# EAGLE board scoutfly_nxp (EAGLE 5.06)
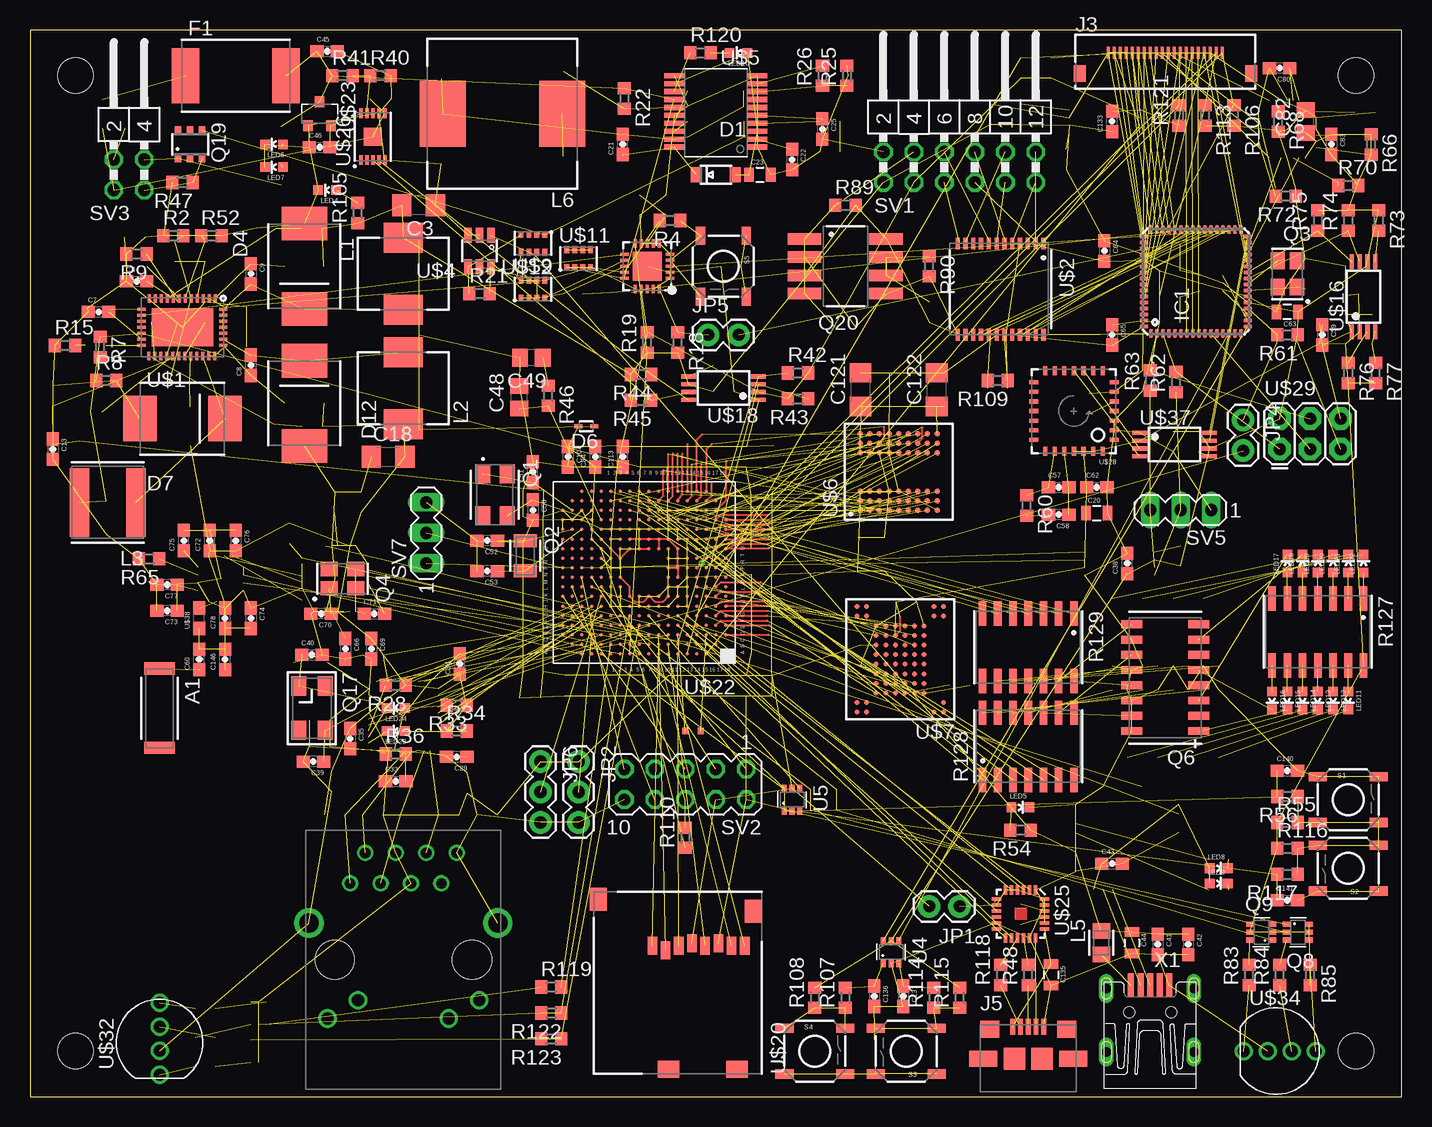
[diagram p8: board, top side]
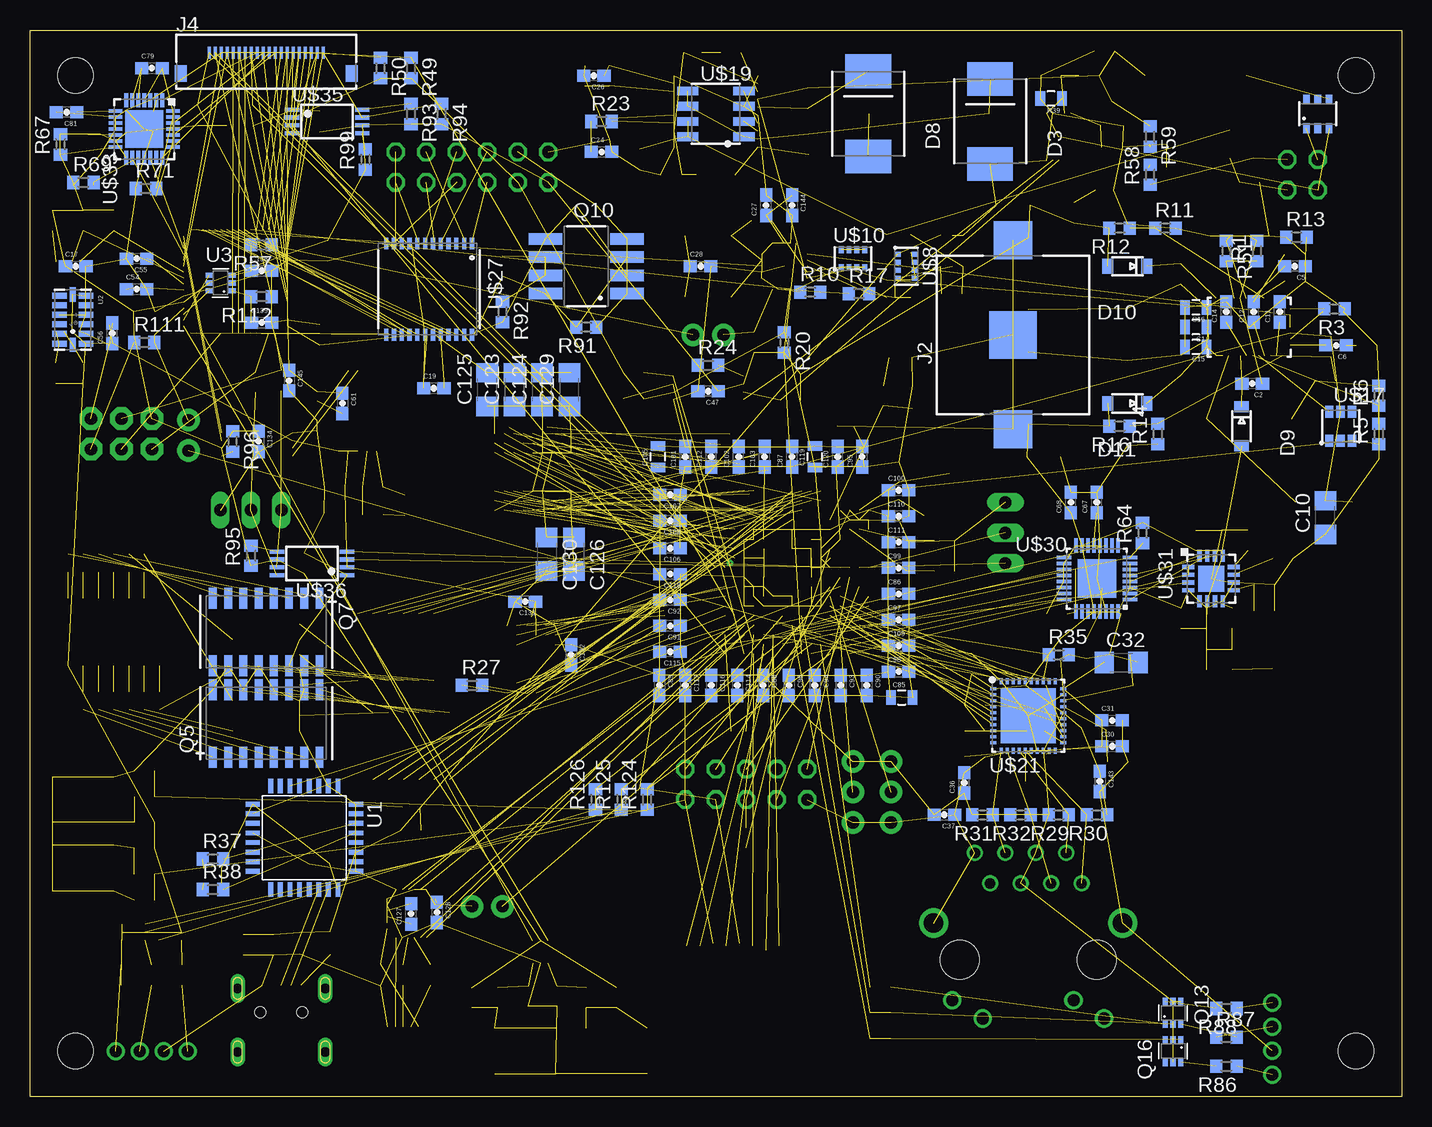
[diagram p9: board, bottom side, seen from below]

Size 114.3 x 88.9 mm. Coordinates in mm from the lower left corner, seen from the top.
Outline: 0,0 114.3,0 114.3,88.9 0,88.9 0,0
Copper layers (1*2+15*16): Top 0.035mm / dielectric 1.5mm / Route2 0.035mm / dielectric 0.15mm / Route15 0.035mm / dielectric 0.2mm / Bottom 0.035mm
Design rules "barebonespcb *": minimum track width 6mil, minimum drill 15mil, track to track 7mil, track to pad 7mil, pad to pad 7mil, via to via 7mil, smd to smd 7mil, copper to edge 10mil, drill to drill 8mil, minimum pad ring 7mil, minimum via ring 7mil, stop-mask expansion 4mil, vias tented up to drill 0mil, thermal gap 10mil
Holes 2.95 mm at 110.49,85.09 110.49,3.81 3.81,3.81 3.81,85.09

## Footprints (pad centres in the part's own frame; a part is rotated, then mirrored left to right if it is on the bottom)
CHIP_ANT_2.4GHZ = smd 1.016 x 2.54: 1 -3.302,0; 2 3.302,0
0805 = smd 0.8 x 1.2: 1 -0.9,0; 2 0.9,0
0603-CAP = smd 1.1 x 1: 1 -0.85,0; 2 0.85,0
C1206 = smd 1.6 x 1.8: 1 -1.4,0; 2 1.4,0
C0805 = smd 1.3 x 1.5: 1 -0.95,0; 2 0.95,0
SOD-123 = smd 0.914 x 1.219: 1 -1.638,0; 2 1.638,0
SMC/DO-214AB = smd 2.8 x 3.8: 1 -3.55,0; 2 3.55,0
SOD523 = smd 0.65 x 0.3: 1 -0.675,0; 2 0.675,0
SM200 = smd 2.3 x 4.6: 1 -4.2,0; 2 4.2,0
MLF64 = smd 0.7 x 0.3: 1 -4.325,3.75; 2 -4.325,3.25; 3 -4.325,2.75; 4 -4.325,2.25; 5 -4.325,1.75; 6 -4.325,1.25; 7 -4.325,0.75; 8 -4.325,0.25; 9 -4.325,-0.25; 10 -4.325,-0.75; 11 -4.325,-1.25; 12 -4.325,-1.75; 13 -4.325,-2.25; 14 -4.325,-2.75; 15 -4.325,-3.25; 16 -4.325,-3.75; 33 4.325,-3.75; 34 4.325,-3.25; 35 4.325,-2.75; 36 4.325,-2.25; 37 4.325,-1.75; 38 4.325,-1.25; 39 4.325,-0.75; 40 4.325,-0.25; 41 4.325,0.25; 42 4.325,0.75; 43 4.325,1.25; 44 4.325,1.75; 45 4.325,2.25; 46 4.325,2.75; 47 4.325,3.25; 48 4.325,3.75 | smd 0.3 x 0.7: 17 -3.75,-4.325; 18 -3.25,-4.325; 19 -2.75,-4.325; 20 -2.25,-4.325; 21 -1.75,-4.325; 22 -1.25,-4.325; 23 -0.75,-4.325; 24 -0.25,-4.325; 25 0.25,-4.325; 26 0.75,-4.325; 27 1.25,-4.325; 28 1.75,-4.325; 29 2.25,-4.325; 30 2.75,-4.325; 31 3.25,-4.325; 32 3.75,-4.325; 49 3.75,4.325; 50 3.25,4.325; 51 2.75,4.325; 52 2.25,4.325; 53 1.75,4.325; 54 1.25,4.325; 55 0.75,4.325; 56 0.25,4.325; 57 -0.25,4.325; 58 -0.75,4.325; 59 -1.25,4.325; 60 -1.75,4.325; 61 -2.25,4.325; 62 -2.75,4.325; 63 -3.25,4.325; 64 -3.75,4.325
RJ45-PULSE = drill 0.889 round: 1 4.445,-6.35; 2 3.175,-8.89; 3 1.905,-6.35; 4 0.635,-8.89; 5 -0.635,-6.35; 6 -1.905,-8.89; 7 -3.175,-6.35; 8 -4.445,-8.89 | drill 1.016 round: 9 6.325,4.902; 10 3.785,3.378; 11 -3.785,4.902; 12 -6.325,3.378 | drill 1.626 round: SHIELD1 -7.874,-3.048; SHIELD2 7.874,-3.048 | hole 3.251: 5.715,0; -5.715,0
COIN_CELL = smd 3.962 x 3.962: NEGATIVE 0,0 | smd 3.175 x 3.175: PLUS1 -7.874,0; PLUS2 7.874,0
OMRON_XF = smd 0.25 x 1: 1 -4.75,0; 2 -4.25,0; 3 -3.75,0; 4 -3.25,0; 5 -2.75,0; 6 -2.25,0; 7 -1.75,0; 8 -1.25,0; 9 -0.75,0; 10 -0.25,0; 11 0.25,0; 12 0.75,0; 13 1.25,0; 14 1.75,0; 15 2.25,0; 16 2.75,0; 17 3.25,0; 18 3.75,0; 19 4.25,0; 20 4.75,0 | smd 1 x 1.34: SOLDER_PAD1 -7.14,-1.72; SOLDER_PAD2 7.14,-1.72
MICRO_USB_AB_TYCO = smd 0.4 x 1.35: 1 -1.3,2.675; 2 -0.65,2.675; 3 0,2.675; 4 0.65,2.675; 5 1.3,2.675 | smd 1.6 x 1.4: PAD1 3.2,2.45; PAD2 -3.2,2.45 | smd 2.3 x 1.3: PAD3 3.75,0; PAD4 -3.75,0 | smd 1.8 x 1.8: PAD5 1.15,0; PAD6 -1.15,0
1X02 = drill 1.016 pad 1.88 round: 1 0,0; 2 2.54,0
1X03 = drill 1.016 pad 1.88 round: 1 0,0; 2 2.54,0; 3 5.08,0
DR74 = smd 2.5 x 3.25: 1 -3,0; 2 3,0
NR6045 = smd 1.6 x 5.7: 1 -2.35,0; 2 2.35,0
0805' = smd 1.285 x 1.47: 1 -0.973,0; 2 0.973,0
DR125 = smd 3.85 x 5.5: 1 -4.975,0; 2 4.975,0
LED-0603 = smd 0.8 x 0.8: A 0,-0.75; C 0,0.75
NX5032SA = smd 1.6 x 1.25: 1 1.75,1.025; 2 -1.75,1.025; 3 -1.75,-1.025; 4 1.75,-1.025
ECX-31B = smd 1.1 x 1.9: 1 -1.25,0; 2 1.25,0
NX3225SA = smd 1.4 x 1.2: 1 -1.1,-0.8; 2 1.1,-0.8; 3 1.1,0.8; 4 -1.1,0.8
16-SOIC = smd 0.65 x 1.75: 1 -4.445,-2.8; 2 -3.175,-2.8; 3 -1.905,-2.8; 4 -0.635,-2.8; 5 0.635,-2.8; 6 1.905,-2.8; 7 3.175,-2.8; 8 4.445,-2.8; 9 4.445,2.8; 10 3.175,2.8; 11 1.905,2.8; 12 0.635,2.8; 13 -0.635,2.8; 14 -1.905,2.8; 15 -3.175,2.8; 16 -4.445,2.8
SOT363 = smd 0.42 x 0.6: 1 -0.65,-0.95; 2 0,-0.95; 3 0.65,-0.95; 4 0.65,0.95; 5 0,0.95; 6 -0.65,0.95
SOT223-8 = smd 0.95 x 2.8: 1 -2.28,-3.4; 2 -0.76,-3.4; 3 0.76,-3.4; 4 2.28,-3.4; 5 2.28,3.4; 6 0.76,3.4; 7 -0.76,3.4; 8 -2.28,3.4
ECX-53B = smd 1.6 x 1.25: 1 -1.85,-1.1; 2 1.85,-1.1; 3 1.85,1.1; 4 -1.85,1.1
SOT26 = smd 0.55 x 0.8: 1 -0.95,-1.2; 2 0,-1.2; 3 0.95,-1.2; 4 0.95,1.2; 5 0,1.2; 6 -0.95,1.2
6-TSOP = smd 0.508 x 0.699: 1 -1.001,-1.163; 2 0,-1.163; 3 1.001,-1.163; 4 1.001,1.163; 5 0,1.163; 6 -1.001,1.163
R0603 = smd 1 x 1.1: 1 -0.85,0; 2 0.85,0
14-SOIC_CTS = smd 2.03 x 0.63: 1 -2.8,3.81; 2 -2.8,2.54; 3 -2.8,1.27; 4 -2.8,0; 5 -2.8,-1.27; 6 -2.8,-2.54; 7 -2.8,-3.81; 8 2.8,-3.81; 9 2.8,-2.54; 10 2.8,-1.27; 11 2.8,0; 12 2.8,1.27; 13 2.8,2.54; 14 2.8,3.81
TACTILE_SWITCH_SMD = smd 1.524 x 0.762: 1 -2.54,1.905; 2 2.54,1.905; 3 -2.54,-1.905; 4 2.54,-1.905
MA06-2W = drill 1.016 octagon: 1 -7.62,-1.27; 2 -7.62,1.27; 3 -5.08,-1.27; 4 -5.08,1.27; 5 -2.54,-1.27; 6 -2.54,1.27; 7 0,-1.27; 8 0,1.27; 9 2.54,-1.27; 10 2.54,1.27; 11 5.08,-1.27; 12 5.08,1.27
MA05-2 = drill 1.016 octagon: 1 -5.08,-1.27; 2 -5.08,1.27; 3 -2.54,-1.27; 4 -2.54,1.27; 5 0,-1.27; 6 0,1.27; 7 2.54,-1.27; 8 2.54,1.27; 9 5.08,-1.27; 10 5.08,1.27
MA02-2W = drill 1.016 octagon: 1 -1.27,-5.08; 2 -1.27,-2.54; 3 1.27,-5.08; 4 1.27,-2.54
MA03-1 = drill 1.016 long: 1 -2.54,0; 2 0,0; 3 2.54,0
PAD.02X.02 = smd 0.508 x 0.508: P$1 0,0
LQFP32 = smd 0.4 x 1.2: 1 -2.8,-4.3; 2 -2,-4.3; 3 -1.2,-4.3; 4 -0.4,-4.3; 5 0.4,-4.3; 6 1.2,-4.3; 7 2,-4.3; 8 2.8,-4.3; 17 2.8,4.3; 18 2,4.3; 19 1.2,4.3; 20 0.4,4.3; 21 -0.4,4.3; 22 -1.2,4.3; 23 -2,4.3; 24 -2.8,4.3 | smd 1.2 x 0.4: 9 4.3,-2.8; 10 4.3,-2; 11 4.3,-1.2; 12 4.3,-0.4; 13 4.3,0.4; 14 4.3,1.2; 15 4.3,2; 16 4.3,2.8; 25 -4.3,2.8; 26 -4.3,2; 27 -4.3,1.2; 28 -4.3,0.4; 29 -4.3,-0.4; 30 -4.3,-1.2; 31 -4.3,-2; 32 -4.3,-2.8
LGA14 = smd 0.5 x 1.2: 1 2,1.1; 2 1.2,1.1; 3 0.4,1.1; 4 -0.4,1.1; 5 -1.2,1.1; 6 -2,1.1; 8 -2,-1.1; 9 -1.2,-1.1; 10 -0.4,-1.1; 11 0.4,-1.1; 12 1.2,-1.1; 13 2,-1.1 | smd 1.2 x 0.5: 7 -2.1,0; 14 2.1,0
38-QFN = smd 0.7 x 0.25: 1 -2.4,2.75; 2 -2.4,2.25; 3 -2.4,1.75; 4 -2.4,1.25; 5 -2.4,0.75; 6 -2.4,0.25; 7 -2.4,-0.25; 8 -2.4,-0.75; 9 -2.4,-1.25; 10 -2.4,-1.75; 11 -2.4,-2.25; 12 -2.4,-2.75; 20 2.4,-2.8; 21 2.4,-2.3; 22 2.4,-1.8; 23 2.4,-1.3; 24 2.4,-0.8; 25 2.4,-0.3; 26 2.4,0.2; 27 2.4,0.7; 28 2.4,1.2; 29 2.4,1.7; 30 2.4,2.2; 31 2.4,2.7 | smd 0.25 x 0.7: 13 -1.5,-3.4; 14 -1,-3.4; 15 -0.5,-3.4; 16 0,-3.4; 17 0.5,-3.4; 18 1,-3.4; 19 1.5,-3.4; 32 1.5,3.4; 33 1,3.4; 34 0.5,3.4; 35 0,3.4; 36 -0.5,3.4; 37 -1,3.4; 38 -1.5,3.4 | smd 3.15 x 5.15: 39 0,0
24-SSOP = smd 0.35 x 0.97: 1 0,-3.81; 2 0.65,-3.81; 3 1.3,-3.81; 4 1.95,-3.81; 5 2.6,-3.81; 6 3.25,-3.81; 7 3.9,-3.81; 8 4.55,-3.81; 9 5.2,-3.81; 10 5.85,-3.81; 11 6.5,-3.81; 12 7.15,-3.81; 13 7.15,3.81; 14 6.5,3.81; 15 5.85,3.81; 16 5.2,3.81; 17 4.55,3.81; 18 3.9,3.81; 19 3.25,3.81; 20 2.6,3.81; 21 1.95,3.81; 22 1.3,3.81; 23 0.65,3.81; 24 0,3.81
20-QFN = smd 0.7 x 0.25: 1 -1.9,1; 2 -1.9,0.5; 3 -1.9,0; 4 -1.9,-0.5; 5 -1.9,-1; 11 1.9,-1; 12 1.9,-0.5; 13 1.9,0; 14 1.9,0.5; 15 1.9,1 | smd 0.25 x 0.7: 6 -1,-1.9; 7 -0.5,-1.9; 8 0,-1.9; 9 0.5,-1.9; 10 1,-1.9; 16 1,1.9; 17 0.5,1.9; 18 0,1.9; 19 -0.5,1.9; 20 -1,1.9 | smd 2.45 x 2.45: 21 0,0
6-TSOT23 = smd 0.62 x 1.22: 1 -0.95,-1.31; 2 0,-1.31; 3 0.95,-1.31; 4 0.95,1.31; 5 0,1.31; 6 -0.95,1.31
20-SSOP = smd 1.651 x 0.432: 1 -3.48,5.944; 2 -3.48,5.283; 3 -3.48,4.623; 4 -3.48,3.962; 5 -3.48,3.302; 6 -3.48,2.642; 7 -3.48,1.981; 8 -3.48,1.321; 9 -3.48,0.66; 10 -3.48,0; 11 3.48,0; 12 3.48,0.66; 13 3.48,1.321; 14 3.48,1.981; 15 3.48,2.642; 16 3.48,3.302; 17 3.48,3.962; 18 3.48,4.623; 19 3.48,5.283; 20 3.48,5.944
54-VFBGA = smd 0.45 x 0.45: A1 -3.2,3.2; A2 -2.4,3.2; A3 -1.6,3.2; A7 1.6,3.2; A8 2.4,3.2; A9 3.2,3.2; B1 -3.2,2.4; B2 -2.4,2.4; B3 -1.6,2.4; B7 1.6,2.4; B8 2.4,2.4; B9 3.2,2.4; C1 -3.2,1.6; C2 -2.4,1.6; C3 -1.6,1.6; C7 1.6,1.6; C8 2.4,1.6; C9 3.2,1.6; D1 -3.2,0.8; D2 -2.4,0.8; D3 -1.6,0.8; D7 1.6,0.8; D8 2.4,0.8; D9 3.2,0.8; E1 -3.2,0; E2 -2.4,0; E3 -1.6,0; E7 1.6,0; E8 2.4,0; E9 3.2,0; F1 -3.2,-0.8; F2 -2.4,-0.8; F3 -1.6,-0.8; F4 1.6,-0.8; F5 2.4,-0.8; F6 3.2,-0.8; G1 -3.2,-1.6; G2 -2.4,-1.6; G3 -1.6,-1.6; G4 1.6,-1.6; G5 2.4,-1.6; G6 3.2,-1.6; H1 -3.2,-2.4; H2 -2.4,-2.4; H3 -1.6,-2.4; H7 1.6,-2.4; H8 2.4,-2.4; H9 3.2,-2.4; J1 -3.2,-3.2; J2 -2.4,-3.2; J3 -1.6,-3.2; J7 1.6,-3.2; J8 2.4,-3.2; J9 3.2,-3.2
63-VFBGA = smd 0.4 x 0.4: A1 -3.6,4.4; A2 -2.8,4.4; A9 2.8,4.4; A10 3.6,4.4; B1 -3.6,3.6; B9 2.8,3.6; B10 3.6,3.6; C3 -2,2.8; C4 -1.2,2.8; C5 -0.4,2.8; C6 0.4,2.8; C7 1.2,2.8; C8 2,2.8; D3 -2,2; D4 -1.2,2; D5 -0.4,2; D6 0.4,2; D7 1.2,2; D8 2,2; E3 -2,1.2; E4 -1.2,1.2; E5 -0.4,1.2; E6 0.4,1.2; E7 1.2,1.2; E8 2,1.2; F3 -2,0.4; F4 -1.2,0.4; F5 -0.4,0.4; F6 0.4,0.4; F7 1.2,0.4; F8 2,0.4; G3 -2,-0.4; G4 -1.2,-0.4; G5 -0.4,-0.4; G6 0.4,-0.4; G7 1.2,-0.4; G8 2,-0.4; H3 -2,-1.2; H4 -1.2,-1.2; H5 -0.4,-1.2; H6 0.4,-1.2; H7 1.2,-1.2; H8 2,-1.2; J3 -2,-2; J4 -1.2,-2; J5 -0.4,-2; J6 0.4,-2; J7 1.2,-2; J8 2,-2; K3 -2,-2.8; K4 -1.2,-2.8; K5 -0.4,-2.8; K6 0.4,-2.8; K7 1.2,-2.8; K8 2,-2.8; L1 -3.6,-3.6; L2 -2.8,-3.6; L9 2.8,-3.6; L10 3.6,-3.6; M1 -3.6,-4.4; M2 -2.8,-4.4; M9 2.8,-4.4; M10 3.6,-4.4
1206-8_CHIPFET = smd 0.406 x 0.559: 1 -0.991,-0.737; 2 -0.33,-0.737; 3 0.33,-0.737; 4 0.991,-0.737; 5 0.991,0.737; 6 0.33,0.737; 7 -0.33,0.737; 8 -0.991,0.737
TSSOP8 = smd 1.2 x 0.35: 1 -2.925,0.975; 2 -2.925,0.325; 3 -2.925,-0.325; 4 -2.925,-0.975; 5 2.925,-0.975; 6 2.925,-0.325; 7 2.925,0.325; 8 2.925,0.975
6-SC74 = smd 1 x 0.7: 1 -1.2,0.95; 2 -1.2,0; 3 -1.2,-0.95; 4 1.2,-0.95; 5 1.2,0; 6 1.2,0.95
8-SOIC = smd 0.72 x 1.78: 1 -1.905,-2.34; 2 -0.635,-2.34; 3 0.635,-2.34; 4 1.905,-2.34; 5 1.905,2.34; 6 0.635,2.34; 7 -0.635,2.34; 8 -1.905,2.34
MICRO_SD = smd 0.8 x 1.5: 1 -9.1,10.7; 2 -8,10.3; 3 -6.9,10.7; 4 -5.8,10.9; 5 -4.7,10.7; 6 -3.6,10.9; 7 -2.5,10.7; 8 -1.4,10.7 | smd 1.4 x 1.9: P$9 -13.6,14.55; P$12 -0.7,13.55 | smd 1.8 x 1.4: P$10 -7.75,0.4; P$11 -2.05,0.4
40-LLP = smd 0.5 x 0.25: 1 -2.9,2.25; 2 -2.9,1.75; 3 -2.9,1.25; 4 -2.9,0.75; 5 -2.9,0.25; 6 -2.9,-0.25; 7 -2.9,-0.75; 8 -2.9,-1.25; 9 -2.9,-1.75; 10 -2.9,-2.25; 21 2.9,-2.25; 22 2.9,-1.75; 23 2.9,-1.25; 24 2.9,-0.75; 25 2.9,-0.25; 26 2.9,0.25; 27 2.9,0.75; 28 2.9,1.25; 29 2.9,1.75; 30 2.9,2.25 | smd 0.25 x 0.5: 11 -2.25,-2.9; 12 -1.75,-2.9; 13 -1.25,-2.9; 14 -0.75,-2.9; 15 -0.25,-2.9; 16 0.25,-2.9; 17 0.75,-2.9; 18 1.25,-2.9; 19 1.75,-2.9; 20 2.25,-2.9; 31 2.25,2.9; 32 1.75,2.9; 33 1.25,2.9; 34 0.75,2.9; 35 0.25,2.9; 36 -0.25,2.9; 37 -0.75,2.9; 38 -1.25,2.9; 39 -1.75,2.9; 40 -2.25,2.9 | smd 4.6 x 4.6: 41 0,0
SOT1048-1 = smd 0.3 x 0.3: A3 -5.184,6.779; A4 -4.387,6.779; A5 -3.589,6.779; A6 -2.792,6.779; A7 -1.994,6.779; A8 -1.196,6.779; A9 -0.399,6.779; A10 0.399,6.779; A11 1.196,6.779; A12 1.994,6.779; A13 2.791,6.779; A14 3.589,6.779; A15 4.386,6.779; A16 5.184,6.779; B2 -5.982,5.982; B3 -5.184,5.982; B4 -4.387,5.982; B5 -3.589,5.982; B6 -2.792,5.982; B7 -1.994,5.982; B8 -1.196,5.982; B9 -0.399,5.982; B10 0.399,5.982; B11 1.196,5.982; B12 1.994,5.982; B13 2.791,5.982; B14 3.589,5.982; B15 4.386,5.982; B16 5.184,5.982; B17 5.982,5.982; C1 -6.779,5.184; C2 -5.982,5.184; C3 -5.184,5.184; C4 -4.387,5.184; C5 -3.589,5.184; C6 -2.792,5.184; C7 -1.994,5.184; C8 -1.196,5.184; C9 -0.399,5.184; C10 0.399,5.184; C11 1.196,5.184; C12 1.994,5.184; C13 2.791,5.184; C14 3.589,5.184; C15 4.386,5.184; C16 5.184,5.184; C17 5.982,5.184; C18 6.779,5.184; D1 -6.779,4.387; D2 -5.982,4.387; D3 -5.184,4.387; D4 -4.387,4.387; D5 -3.589,4.387; D6 -2.792,4.387; D7 -1.994,4.387; D8 -1.196,4.387; D9 -0.399,4.387; D10 0.399,4.387; D11 1.196,4.387; D12 1.994,4.387; D13 2.791,4.387; D14 3.589,4.387; D15 4.386,4.387; D16 5.184,4.387; D17 5.982,4.387; D18 6.779,4.387; E1 -6.779,3.589; E2 -5.982,3.589; E3 -5.184,3.589; E4 -4.387,3.589; E5 -3.589,3.589; E6 -2.792,3.589; E7 -1.994,3.589; E8 -1.196,3.589; E9 -0.399,3.589; E10 0.399,3.589; E11 1.196,3.589; E12 1.994,3.589; E13 2.791,3.589; E14 3.589,3.589; E15 4.386,3.589; E16 5.184,3.589; E17 5.982,3.589; E18 6.779,3.589; F1 -6.779,2.792; F2 -5.982,2.792; F3 -5.184,2.792; F4 -4.387,2.792; F5 -3.589,2.792; F6 -2.792,2.792; F7 -1.994,2.792; F8 -1.196,2.792; F9 -0.399,2.792; F10 0.399,2.792; F11 1.196,2.792; F12 1.994,2.792; F13 2.791,2.792; F14 3.589,2.792; F15 4.386,2.792; F16 5.184,2.792; F17 5.982,2.792; F18 6.779,2.792; G1 -6.779,1.994; G2 -5.982,1.994; G3 -5.184,1.994; G4 -4.387,1.994; G5 -3.589,1.994; G6 -2.792,1.994; G7 -1.994,1.994; G8 -1.196,1.994; G9 -0.399,1.994; G10 0.399,1.994; G11 1.196,1.994; G12 1.994,1.994; G13 2.791,1.994; G14 3.589,1.994; G15 4.386,1.994; G16 5.184,1.994; G17 5.982,1.994; G18 6.779,1.994; H1 -6.779,1.196; H2 -5.982,1.196; H3 -5.184,1.196; H4 -4.387,1.196; H5 -3.589,1.196; H6 -2.792,1.196; H7 -1.994,1.196; H12 1.994,1.196; H13 2.791,1.196; H14 3.589,1.196; H15 4.386,1.196; H16 5.184,1.196; H17 5.982,1.196; H18 6.779,1.196; J1 -6.779,0.399; J2 -5.982,0.399; J3 -5.184,0.399; J4 -4.387,0.399; J5 -3.589,0.399; J6 -2.792,0.399; J7 -1.994,0.399; J12 1.994,0.4; J13 2.791,0.399; J14 3.589,0.399; J15 4.386,0.399; J16 5.184,0.399; J17 5.982,0.399; J18 6.779,0.399; K1 -6.779,-0.399; K2 -5.982,-0.399; K3 -5.184,-0.399; K4 -4.387,-0.399; K5 -3.589,-0.399; K6 -2.792,-0.399; K7 -1.994,-0.399; K12 1.994,-0.399; K13 2.791,-0.399; K14 3.589,-0.399; K15 4.386,-0.399; K16 5.184,-0.399; K17 5.982,-0.399; K18 6.779,-0.399; L1 -6.779,-1.196; L2 -5.982,-1.196; L3 -5.184,-1.196; L4 -4.387,-1.196; L5 -3.589,-1.196; L6 -2.792,-1.196; L7 -1.994,-1.196; L12 1.994,-1.196; L13 2.791,-1.196; L14 3.589,-1.196; L15 4.386,-1.196; L16 5.184,-1.196; L17 5.982,-1.196; L18 6.779,-1.196; M1 -6.779,-1.994; M2 -5.982,-1.994; M3 -5.184,-1.994; M4 -4.387,-1.994; M5 -3.589,-1.994; M6 -2.792,-1.994; M7 -1.994,-1.994; M8 -1.196,-1.994; M9 -0.399,-1.994; M10 0.399,-1.994; M11 1.196,-1.994; M12 1.994,-1.994; M13 2.791,-1.994; M14 3.589,-1.994; M15 4.386,-1.994; M16 5.184,-1.994; M17 5.982,-1.994; M18 6.779,-1.994; N1 -6.779,-2.791; N2 -5.982,-2.791; N3 -5.184,-2.791; N4 -4.387,-2.791; N5 -3.589,-2.791; N6 -2.792,-2.791; N7 -1.994,-2.791; N8 -1.196,-2.791; N9 -0.399,-2.791; N10 0.399,-2.791; N11 1.196,-2.791; N12 1.994,-2.791; N13 2.791,-2.791; N14 3.589,-2.791; N15 4.386,-2.791; N16 5.184,-2.791; N17 5.982,-2.791; N18 6.779,-2.791; P1 -6.779,-3.589; P2 -5.982,-3.589; P3 -5.184,-3.589; P4 -4.387,-3.589; P5 -3.589,-3.589; P6 -2.792,-3.589; P7 -1.994,-3.589; P8 -1.196,-3.589; P9 -0.399,-3.589; P10 0.399,-3.589; P11 1.196,-3.589; P12 1.994,-3.589; P13 2.791,-3.589; P14 3.589,-3.589; P15 4.386,-3.589; P16 5.184,-3.589; P17 5.982,-3.589; P18 6.779,-3.589; R1 -6.779,-4.386; R2 -5.982,-4.386; R3 -5.184,-4.386; R4 -4.387,-4.386; R5 -3.589,-4.386; R6 -2.792,-4.386; R7 -1.994,-4.386; R8 -1.196,-4.386; R9 -0.399,-4.386; R10 0.399,-4.386; R11 1.196,-4.386; R12 1.994,-4.386; R13 2.791,-4.386; R14 3.589,-4.386; R15 4.386,-4.386; R16 5.184,-4.386; R17 5.982,-4.386; R18 6.779,-4.386; T1 -6.779,-5.184; T2 -5.982,-5.184; T3 -5.184,-5.184; T4 -4.387,-5.184; T5 -3.589,-5.184; T6 -2.792,-5.184; T7 -1.994,-5.184; T8 -1.196,-5.184; T9 -0.399,-5.184; T10 0.399,-5.184; T11 1.196,-5.184; T12 1.994,-5.184; T13 2.791,-5.184; T14 3.589,-5.184; T15 4.386,-5.184; T16 5.184,-5.184; T17 5.982,-5.184; T18 6.779,-5.184; U2 -5.982,-5.982; U3 -5.184,-5.982; U4 -4.387,-5.982; U5 -3.589,-5.982; U6 -2.792,-5.982; U7 -1.994,-5.982; U8 -1.196,-5.982; U9 -0.399,-5.982; U10 0.399,-5.982; U11 1.196,-5.982; U12 1.994,-5.982; U13 2.791,-5.982; U14 3.589,-5.982; U15 4.386,-5.982; U16 5.184,-5.982; U17 5.982,-5.982; V3 -5.184,-6.779; V4 -4.387,-6.779; V5 -3.589,-6.779; V6 -2.792,-6.779; V7 -1.994,-6.779; V8 -1.196,-6.779; V9 -0.399,-6.779; V10 0.399,-6.779; V11 1.196,-6.779; V12 1.994,-6.779; V13 2.791,-6.779; V14 3.589,-6.779; V15 4.386,-6.779; V16 5.184,-6.779
SOT23 = smd 0.8 x 0.9: 1 -0.95,-1; 2 0.95,-1; 3 0,1
QFN-24 = smd 0.8 x 0.3: 1 -2,1.25; 2 -2,0.75; 3 -2,0.25; 4 -2,-0.25; 5 -2,-0.75; 6 -2,-1.25; 13 2,-1.25; 14 2,-0.75; 15 2,-0.25; 16 2,0.25; 17 2,0.75; 18 2,1.25 | smd 0.3 x 0.8: 7 -1.25,-2; 8 -0.75,-2; 9 -0.25,-2; 10 0.25,-2; 11 0.75,-2; 12 1.25,-2; 19 1.25,2; 20 0.75,2; 21 0.25,2; 22 -0.25,2; 23 -0.75,2; 24 -1.25,2
10-TDFN = smd 0.805 x 0.3: 1 -1.952,1; 2 -1.952,0.5; 3 -1.952,0; 4 -1.952,-0.5; 5 -1.952,-1; 6 1.952,-1; 7 1.952,-0.5; 8 1.952,0; 9 1.952,0.5; 10 1.952,1 | smd 1.5 x 1.5: 11 0,0
LGA28 = smd 0.75 x 0.35: 1 -3.35,2.4; 2 -3.35,1.6; 3 -3.35,0.8; 4 -3.35,0; 5 -3.35,-0.8; 6 -3.35,-1.6; 7 -3.35,-2.4; 15 3.35,-2.4; 16 3.35,-1.6; 17 3.35,-0.8; 18 3.35,0; 19 3.35,0.8; 20 3.35,1.6; 21 3.35,2.4 | smd 0.35 x 0.75: 8 -2.4,-3.35; 9 -1.6,-3.35; 10 -0.8,-3.35; 11 0,-3.35; 12 0.8,-3.35; 13 1.6,-3.35; 14 2.4,-3.35; 22 2.4,3.35; 23 1.6,3.35; 24 0.8,3.35; 25 0,3.35; 26 -0.8,3.35; 27 -1.6,3.35; 28 -2.4,3.35
2X3 = drill 1.016 pad 1.88 octagon: 1 0,0; 2 0,2.54; 3 2.54,0; 4 2.54,2.54; 5 5.08,0; 6 5.08,2.54
32-QFN = smd 1.2 x 0.3: 1 -2.75,1.75; 2 -2.75,1.25; 3 -2.75,0.75; 4 -2.75,0.25; 5 -2.75,-0.25; 6 -2.75,-0.75; 7 -2.75,-1.25; 8 -2.75,-1.75; 17 2.75,-1.75; 18 2.75,-1.25; 19 2.75,-0.75; 20 2.75,-0.25; 21 2.75,0.25; 22 2.75,0.75; 23 2.75,1.25; 24 2.75,1.75 | smd 0.3 x 1.2: 9 -1.75,-2.75; 10 -1.25,-2.75; 11 -0.75,-2.75; 12 -0.25,-2.75; 13 0.25,-2.75; 14 0.75,-2.75; 15 1.25,-2.75; 16 1.75,-2.75; 25 1.75,2.75; 26 1.25,2.75; 27 0.75,2.75; 28 0.25,2.75; 29 -0.25,2.75; 30 -0.75,2.75; 31 -1.25,2.75; 32 -1.75,2.75 | smd 3.2 x 3.2: 33 0,0
16-QFN = smd 1 x 0.35: 1 -1.9,0.975; 2 -1.9,0.325; 3 -1.9,-0.325; 4 -1.9,-0.975; 9 1.9,-0.975; 10 1.9,-0.325; 11 1.9,0.325; 12 1.9,0.975 | smd 0.35 x 1: 5 -0.975,-1.9; 6 -0.325,-1.9; 7 0.325,-1.9; 8 0.975,-1.9; 13 0.975,1.9; 14 0.325,1.9; 15 -0.325,1.9; 16 -0.975,1.9 | smd 2.16 x 2.16: 17 0,0
LED-TRICOLOR-THROUGHHOLE = drill 1 round: BLU 1,0; GND -1,0; GRN 3,0; RED -3,0
28-QFN = smd 1.15 x 0.3: 1 -2.4,1.5; 2 -2.4,1; 3 -2.4,0.5; 4 -2.4,0; 5 -2.4,-0.5; 6 -2.4,-1; 7 -2.4,-1.5; 15 2.4,-1.5; 16 2.4,-1; 17 2.4,-0.5; 18 2.4,0; 19 2.4,0.5; 20 2.4,1; 21 2.4,1.5 | smd 0.3 x 1.15: 8 -1.5,-2.4; 9 -1,-2.4; 10 -0.5,-2.4; 11 0,-2.4; 12 0.5,-2.4; 13 1,-2.4; 14 1.5,-2.4; 22 1.5,2.4; 23 1,2.4; 24 0.5,2.4; 25 0,2.4; 26 -0.5,2.4; 27 -1,2.4; 28 -1.5,2.4 | smd 3.15 x 3.15: 29 0,0
0603 = smd 1.1 x 1: 1 -0.85,0; 2 0.85,0
UX60-MB-5S8 = smd 2 x 0.5: 1 8.65,1.6; 2 8.65,0.8; 3 8.65,0; 4 8.65,-0.8; 5 8.65,-1.6 | drill 0.8 long: M1 3.1,-3.65; M2 3.1,3.65; M3 8.4,3.65; M4 8.4,-3.65 | hole 0.9: 6.4,-1.75; 6.4,1.75

## Placement (x,y rotation side)
A1  ANT-2.4-CHP  [CHIP_ANT_2.4GHZ]  10.79,32.38 270 top
C1  10uF  [0805]  17.14,64.14 180 bottom
C2  0.1uF  [0603-CAP]  12.45,59.44 180 bottom
C3  15uF  [C1206]  32.38,74.3 180 top
C4  1500pF  [0603-CAP]  8.89,67.94 0 top
C5  1000pF  [0603-CAP]  8.89,69.22 180 bottom
C6  2000pF  [0603-CAP]  5.46,62.61 180 bottom
C7  1500pF  [0603-CAP]  5.71,65.41 0 top
C8  0.1uF  [0603-CAP]  18.41,60.96 90 top
C9  0.1uF  [0603-CAP]  18.41,68.58 270 top
C10  47uF  [C1206]  6.35,48.26 90 bottom
C11  4700pF  [0603-CAP]  10.16,65.41 90 bottom
C12  1000pF  [0603-CAP]  12.32,65.41 90 bottom
C13  2.2uF  [0603-CAP]  1.91,53.98 270 top
C14  220pF  [0603-CAP]  14.61,65.41 90 bottom
C15  10uF  [0805]  17.14,62.48 180 bottom
C16  10uF  [0805]  17.14,65.79 180 bottom
C17  0.1uF  [0603-CAP]  110.49,69.22 0 bottom
C18  15uF  [C1206]  29.84,53.34 0 top
C19  0.1uF  [0603-CAP]  80.64,59.05 0 bottom
C20  10uF  [0805]  88.9,48.64 0 top
C21  0.1uF  [0603-CAP]  49.4,79.38 90 top
C22  0.1uF  [0603-CAP]  63.5,78.11 270 top
C23  4.7uF  [0805]  60.83,76.83 0 top
C24  0.1uF  [0603-CAP]  66.67,78.74 0 bottom
C25  0.047uF  [0603-CAP]  66.04,80.64 270 top
C26  0.1uF  [0603-CAP]  67.31,85.09 180 bottom
C27  0.1uF  [0603-CAP]  52.96,74.3 90 bottom
C28  0.1uF  [0603-CAP]  58.42,69.22 0 bottom
C29  0.1uF  [0603-CAP]  35.56,28.32 180 top
C30  0.1uF  [0603-CAP]  24.13,29.21 0 bottom
C31  0.1uF  [0603-CAP]  24.13,31.37 0 bottom
C32  10uF  [C1206]  23.37,36.2 0 bottom
C33  0.1uF  [0603-CAP]  30.48,26.29 0 top
C34  0.1uF  [0603-CAP]  35.81,36.07 90 top
C35  0.1uF  [0603-CAP]  26.67,29.84 270 top
C36  0.1uF  [0603-CAP]  36.45,26.16 90 bottom
C37  0.1uF  [0603-CAP]  38.1,23.5 180 bottom
C38  0.1uF  [0603-CAP]  91.44,44.45 90 top
C39  33pF  [0603-CAP]  23.62,27.94 180 top
C40  33pF  [0603-CAP]  23.5,36.83 0 top
C41  0.1uF  [0603-CAP]  93.98,12.7 270 top
C42  0.01uF  [0603-CAP]  96.52,12.7 270 top
C43  0.1uF  [0603-CAP]  90.17,19.43 0 top
C44  4.7uF  [0805]  91.82,12.83 270 top
C45  1uF  [0603-CAP]  24.77,87.12 0 top
C46  1uF  [0603-CAP]  24.13,79.12 0 top
C47  0.1uF  [0603-CAP]  57.78,58.8 180 bottom
C48  150pF  [C0805]  40.77,58.29 90 top
C49  3900pF  [C0805]  41.78,61.59 180 top
C50  18pF  [0603-CAP]  41.91,48.9 270 top
C51  18pF  [0603-CAP]  41.91,52.07 90 top
C52  18pF  [0603-CAP]  38.1,46.35 180 top
C53  18pF  [0603-CAP]  38.1,43.81 180 top
C54  18pF  [0603-CAP]  105.41,67.31 0 bottom
C55  18pF  [0603-CAP]  105.41,69.85 180 bottom
C56  0.1uF  [0603-CAP]  107.44,63.63 90 bottom
C57  0.01uF  [0603-CAP]  85.72,50.8 0 top
C58  0.47uF  [0603-CAP]  85.72,48.51 180 top
C59  0.1uF  [0603-CAP]  107.7,63.5 270 top
C60  1000pF  [0603-CAP]  14.1,36.45 90 top
C61  0.01uF  [0603-CAP]  88.27,57.78 270 bottom
C62  0.1uF  [0603-CAP]  88.9,50.8 0 top
C63  10uF  [0805]  104.78,65.41 180 top
C64  0.1uF  [0603-CAP]  89.53,70.48 270 top
C65  0.1uF  [0603-CAP]  90.17,63.5 270 top
C66  1uF  [0603-CAP]  26.29,37.34 270 top
C67  1uF  [0603-CAP]  25.4,49.53 90 bottom
C68  1uF  [0603-CAP]  27.56,49.53 90 bottom
C69  1uF  [0603-CAP]  28.45,37.34 270 top
C70  18pF  [0603-CAP]  24.26,40.26 180 top
C71  18pF  [0603-CAP]  28.7,40.26 0 top
C72  10pF  [0603-CAP]  14.99,46.35 90 top
C73  10pF  [0603-CAP]  11.43,40.51 180 top
C74  1000pF  [0603-CAP]  18.41,39.88 270 top
C75  1000pF  [0603-CAP]  12.83,46.35 90 top
C76  18pF  [0603-CAP]  17.14,46.35 270 top
C77  1000pF  [0603-CAP]  11.43,42.67 180 top
C78  1000pF  [0603-CAP]  16.26,39.88 90 top
C79  0.1uF  [0603-CAP]  104.14,85.72 0 bottom
C80  0.1uF  [0603-CAP]  104.14,85.72 180 top
C81  0.22uF  [0603-CAP]  111.25,82.04 180 bottom
C82  4.7uF  [C0805]  106.3,81.28 90 top
C83  1uF  [0603-CAP]  108.46,79.38 270 top
C84  0.01uF  [0603-CAP]  47.12,53.34 90 top
C85  10uF  [0805]  41.66,33.27 0 bottom
C86  0.1uF  [0603-CAP]  41.91,41.91 0 bottom
C87  0.1uF  [0603-CAP]  50.8,53.34 90 bottom
C88  0.01uF  [0603-CAP]  53.21,34.29 270 bottom
C89  0.01uF  [0603-CAP]  61.85,34.29 270 bottom
C90  0.1uF  [0603-CAP]  44.58,34.29 270 bottom
C91  0.01uF  [0603-CAP]  60.96,39.24 180 bottom
C92  0.01uF  [0603-CAP]  60.96,41.4 180 bottom
C93  0.1uF  [0603-CAP]  46.74,34.29 270 bottom
C94  0.1uF  [0603-CAP]  48.9,34.29 270 bottom
C95  0.01uF  [0603-CAP]  44.96,53.34 90 bottom
C96  0.1uF  [0603-CAP]  51.05,34.29 270 bottom
C97  0.01uF  [0603-CAP]  41.91,39.75 0 bottom
C98  0.01uF  [0603-CAP]  41.91,35.43 0 bottom
C99  0.01uF  [0603-CAP]  41.91,44.07 0 bottom
C100  0.01uF  [0603-CAP]  41.91,50.55 0 bottom
C101  0.1uF  [0603-CAP]  59.69,53.34 90 bottom
C102  0.1uF  [0603-CAP]  55.24,53.34 90 bottom
C103  0.1uF  [0603-CAP]  53.09,53.34 90 bottom
C104  0.1uF  [0603-CAP]  44.83,53.34 270 top
C105  10uF  [0805]  61.98,53.34 90 bottom
C106  0.01uF  [0603-CAP]  60.96,45.72 180 bottom
C107  0.01uF  [0603-CAP]  60.96,50.16 180 bottom
C108  0.01uF  [0603-CAP]  60.96,48.01 180 bottom
C109  0.1uF  [0603-CAP]  41.91,37.59 0 bottom
C110  0.1uF  [0603-CAP]  41.91,48.39 0 bottom
C111  0.1uF  [0603-CAP]  41.91,46.23 0 bottom
C112  0.01uF  [0603-CAP]  57.53,53.34 90 bottom
C113  0.1uF  [0603-CAP]  49.4,53.34 90 top
C114  0.1uF  [0603-CAP]  55.37,34.29 270 bottom
C115  0.1uF  [0603-CAP]  60.96,37.08 180 bottom
C116  0.1uF  [0603-CAP]  57.53,34.29 270 bottom
C117  0.1uF  [0603-CAP]  59.69,34.29 270 bottom
C118  0.1uF  [0603-CAP]  60.96,43.56 180 bottom
C119  10uF  [0805]  48.9,53.34 90 bottom
C120  0.01uF  [0603-CAP]  46.99,53.34 90 bottom
C121  0.1uF  [C1206]  69.22,58.93 90 top
C122  0.1uF  [C1206]  75.56,58.93 90 top
C123  0.1uF  [C1206]  73.91,58.93 90 bottom
C124  0.1uF  [C1206]  71.63,58.93 90 bottom
C125  0.1uF  [C1206]  76.2,58.93 90 bottom
C126  0.1uF  [C1206]  68.96,45.21 270 bottom
C127  0.22uF  [0603-CAP]  82.55,15.24 90 bottom
C128  1uF  [0603-CAP]  80.39,15.37 270 bottom
C129  0.22uF  [C1206]  69.34,58.93 90 bottom
C130  0.22uF  [C1206]  71.25,45.21 270 bottom
C131  0.1uF  [0603-CAP]  73.03,41.27 180 bottom
C132  0.1uF  [0603-CAP]  69.22,36.83 270 bottom
C133  0.1uF  [0603-CAP]  90.17,81.28 90 top
C134  0.1uF  [0603-CAP]  95.25,54.61 270 bottom
C135  4.7uF  [0805]  85.09,10.16 270 top
C136  1uF  [0603-CAP]  70.36,8.38 270 top
C137  1uF  [0603-CAP]  72.77,8.38 270 top
C138  1uF  [0603-CAP]  95,68.83 0 bottom
C139  1uF  [0603-CAP]  95,64.52 0 bottom
C140  1uF  [0603-CAP]  104.78,27.18 0 top
C141  1uF  [0603-CAP]  104.78,16.38 0 top
C143  0.1uF  [0603-CAP]  25.15,26.29 270 bottom
C144  0.1uF  [0603-CAP]  50.8,74.3 270 bottom
C145  430pF  [0603-CAP]  92.71,59.69 270 bottom
C146  1pF  [0603-CAP]  16.26,36.45 90 top
D1  1N41482  [SOD-123]  57.15,76.83 180 top
D3  MBRS340  [SMC/DO-214AB]  34.29,81.28 90 bottom
D4  MBRS340  [SMC/DO-214AB]  22.86,69.22 270 top
D6  BAS69KFILM  [SOD523]  46.35,55.88 180 top
D7  MBRS340  [SMC/DO-214AB]  12.7,56.52 0 top
D8  MBRS340  [SMC/DO-214AB]  44.45,81.92 90 bottom
D9  1N41482  [SOD-123]  13.34,55.88 90 bottom
D10  1N41482  [SOD-123]  22.86,69.22 0 bottom
D11  1N41482  [SOD-123]  22.86,57.78 0 bottom
D12  MBRS340  [SMC/DO-214AB]  22.86,57.78 90 top
F1  [SM200]  17.14,85.09 0 top
IC1  MEGA128-M  [MLF64]  97.16,67.94 90 top
J1  RJ45_PULSE  [RJ45-PULSE]  31.11,11.43 180 top
J2  KEYSTONE_3000  [COIN_CELL]  32.38,63.5 270 bottom
J3  XF2L  [OMRON_XF]  94.61,87 0 top
J4  XF2L  [OMRON_XF]  94.61,87 0 bottom
J5  USB_MICRO_AB  [MICRO_USB_AB_TYCO]  83.19,3.17 0 top
JP1  [1X02]  77.47,15.88 180 top
JP2  JUMPER-3PTH  [1X03]  45.72,27.94 270 top
JP4  [1X02]  101.09,56.39 270 top
JP5  [1X02]  56.52,63.5 0 top
JP6  JUMPER-3PTH  [1X03]  42.55,27.94 270 top
L1  4.7uH  [DR74]  31.11,68.58 270 top
L2  4.7uH  [DR74]  31.11,59.05 90 top
L3  3uH  [NR6045]  6.48,49.53 180 top
L5  MI0805K400R-10  [0805']  89.28,12.83 270 top
L6  22uH  [DR125]  39.37,81.92 180 top
LED4  Blue  [LED-0603]  24.77,75.56 90 top
LED5  Blue  [LED-0603]  82.55,24.13 270 top
LED6  Blue  [LED-0603]  20.32,79.38 90 top
LED7  Blue  [LED-0603]  20.32,77.47 90 top
LED8  Green  [LED-0603]  99.06,19.05 270 top
LED9  Red  [LED-0603]  99.06,17.78 270 top
LED10  Blue  [LED-0603]  59.05,87 90 top
LED11  Green  [LED-0603]  109.86,33.02 180 top
LED12  Green  [LED-0603]  108.58,33.02 180 top
LED13  Green  [LED-0603]  107.31,33.02 180 top
LED14  Green  [LED-0603]  106.05,33.02 180 top
LED15  Green  [LED-0603]  104.78,33.02 180 top
LED16  Green  [LED-0603]  103.5,33.02 180 top
LED17  Red  [LED-0603]  104.78,44.45 0 top
LED18  Red  [LED-0603]  106.05,44.45 0 top
LED19  Red  [LED-0603]  107.31,44.45 0 top
LED20  Red  [LED-0603]  108.58,44.45 0 top
LED21  Red  [LED-0603]  109.86,44.45 0 top
LED22  Red  [LED-0603]  111.12,44.45 0 top
LED23  Green  [LED-0603]  30.48,30.48 90 top
LED24  Green  [LED-0603]  30.48,32.38 90 top
Q1  13MHz  [NX5032SA]  38.73,50.16 270 top
Q2  32.768kHz  [ECX-31B]  41.27,45.09 270 top
Q3  16MHz  [NX3225SA]  104.78,68.58 90 top
Q4  16MHz  [NX3225SA]  26.04,43.18 0 top
Q5  MMPQ3904  [16-SOIC]  94.61,31.11 0 bottom
Q6  MMPQ3904  [16-SOIC]  94.61,34.92 90 top
Q7  MMPQ3904  [16-SOIC]  94.61,38.73 180 bottom
Q8  DMMT3906W  [SOT363]  105.66,13.72 270 top
Q9  DMMT3906W  [SOT363]  102.62,13.72 90 top
Q10  ZDT1053  [SOT223-8]  67.94,69.22 90 bottom
Q13  DMMT3906W  [SOT363]  19.05,6.99 0 bottom
Q16  DMMT3906W  [SOT363]  19.05,3.81 180 bottom
Q17  [ECX-53B]  23.5,32.38 270 top
Q18  DMP266LDM  [SOT26]  6.99,81.92 0 bottom
Q19  SI3493BDV  [6-TSOP]  13.34,79.38 0 top
Q20  ZDT1053  [SOT223-8]  67.94,69.22 270 top
R1  10K  [R0603]  12.06,70.48 90 bottom
R2  1.1K  [R0603]  11.94,71.75 0 top
R3  33.833K  [R0603]  5.59,65.66 180 bottom
R4  10K  [R0603]  53.34,73.03 180 top
R5  1K  [R0603]  1.91,55.24 90 bottom
R6  2K  [R0603]  1.91,58.42 90 bottom
R7  1.02K  [R0603]  5.84,62.48 270 top
R8  806  [R0603]  6.35,59.69 0 top
R9  13.3K  [R0603]  8.89,70.23 180 top
R10  1.07K  [R0603]  49.28,67.06 0 bottom
R11  953  [R0603]  19.68,72.39 0 bottom
R12  4.99K  [R0603]  23.5,72.39 180 bottom
R13  16.2K  [R0603]  8.76,71.63 0 bottom
R14  1.07K  [R0603]  20.32,55.24 90 bottom
R15  7.32K  [R0603]  2.92,62.61 0 top
R16  3.32K  [R0603]  23.5,55.88 180 bottom
R17  1.07K  [R0603]  45.21,66.93 0 bottom
R18  10K  [R0603]  53.98,62.87 270 top
R19  10K  [R0603]  51.44,62.87 90 top
R20  10K  [R0603]  51.44,62.87 270 bottom
R21  470K  [R0603]  37.47,66.93 0 top
R22  0.1  [R0603]  49.53,83.19 270 top
R23  10K  [R0603]  66.67,81.28 0 bottom
R24  200K  [R0603]  57.78,60.96 0 bottom
R25  100K  [R0603]  68.07,85.09 90 top
R26  50K  [R0603]  66.04,85.09 90 top
R27  10K  [R0603]  77.47,34.29 0 bottom
R28  10K  [R0603]  30.48,34.29 180 top
R29  49.9  [R0603]  28.57,23.5 180 bottom
R30  49.9  [R0603]  25.4,23.5 180 bottom
R31  49.9  [R0603]  34.92,23.5 180 bottom
R32  49.9  [R0603]  31.75,23.5 180 bottom
R33  65  [R0603]  35.56,32.64 180 top
R34  60  [R0603]  35.56,30.48 0 top
R35  2.2K  [R0603]  28.57,36.83 0 bottom
R36  4.87K  [R0603]  30.48,28.57 0 top
R37  60  [R0603]  99.06,19.81 0 bottom
R38  65  [R0603]  99.06,17.27 0 bottom
R39  0.01, 1%, 1/4W  [0805]  29.21,83.19 180 bottom
R40  50K  [R0603]  29.21,85.09 0 top
R41  50K  [R0603]  26.04,85.09 0 top
R42  983  [R0603]  64.01,60.33 0 top
R43  983  [R0603]  64.01,58.17 180 top
R44  1.55K  [R0603]  50.93,60.2 180 top
R45  1.55K  [R0603]  50.93,58.04 180 top
R46  120K  [R0603]  43.18,58.42 270 top
R47  0  [R0603]  12.7,76.2 180 top
R48  20  [R0603]  83.19,10.16 90 top
R49  983  [R0603]  82.55,85.72 270 bottom
R50  983  [R0603]  85.09,85.72 270 bottom
R51  3.9K  [R0603]  14.61,70.48 270 bottom
R52  910  [R0603]  15.11,71.75 0 top
R54  85  [R0603]  82.55,22.23 180 top
R55  32.4K  [R0603]  104.78,22.86 0 top
R56  30.1K  [R0603]  104.78,25.02 180 top
R57  18K  [R0603]  95,70.99 180 bottom
R58  435  [R0603]  20.95,76.83 90 bottom
R59  185  [R0603]  20.95,80.01 270 bottom
R60  10K  [R0603]  83.06,49.28 270 top
R61  11.3K  [R0603]  104.78,63.5 180 top
R62  4.7K  [R0603]  95.5,59.56 90 top
R63  4.7K  [R0603]  93.34,59.69 90 top
R64  3.3K  [R0603]  21.59,46.99 90 bottom
R65  4.3K  [R0603]  9.91,44.83 180 top
R66  10K  [R0603]  111.76,79.38 270 top
R67  10K  [R0603]  111.76,79.38 90 bottom
R68  10K  [R0603]  104.01,81.28 270 top
R69  61.9K  [R0603]  109.86,76.2 0 bottom
R70  976  [R0603]  109.86,75.95 0 top
R71  0.05  [R0603]  104.65,75.69 0 bottom
R72  0.05  [R0603]  104.65,75.06 180 top
R73  250K  [R0603]  112.39,73.03 270 top
R74  1.55K  [R0603]  109.86,73.03 90 top
R75  1.55K  [R0603]  107.31,73.03 90 top
R76  983  [R0603]  109.86,60.33 270 top
R77  983  [R0603]  112.14,60.33 270 top
R83  64.9  [R0603]  101.6,10.16 90 top
R84  18  [R0603]  104.14,10.16 90 top
R85  18  [R0603]  106.68,10.16 270 top
R86  64.9  [R0603]  14.61,2.54 180 bottom
R87  18  [R0603]  14.61,4.95 0 bottom
R88  18  [R0603]  14.61,7.37 180 bottom
R89  70  [R0603]  67.94,74.3 0 top
R90  0.5, 1+ W  [R0603]  74.93,69.22 270 top
R91  70  [R0603]  67.94,64.14 180 bottom
R92  0.5, 1+ W  [R0603]  74.93,65.41 270 bottom
R93  1.55K  [R0603]  82.55,81.92 270 bottom
R94  1.55K  [R0603]  80.01,81.92 270 bottom
R95  200K  [R0603]  95.89,45.09 90 bottom
R96  250K  [R0603]  97.41,54.61 270 bottom
R99  200K  [R0603]  86.36,78.11 90 bottom
R105  85  [R0603]  27.3,73.66 90 top
R106  82K  [R0603]  100.33,81.79 270 top
R107  18K  [R0603]  67.94,8.26 90 top
R108  82K  [R0603]  65.41,8.26 90 top
R109  10K  [R0603]  80.64,59.69 180 top
R110  4.7K  [R0603]  54.61,21.59 90 top
R111  1.87K  [R0603]  104.78,62.87 0 bottom
R112  18K  [R0603]  95,66.67 180 bottom
R113  82K  [R0603]  97.92,81.79 270 top
R114  18K  [R0603]  75.31,8.26 90 top
R115  82K  [R0603]  77.47,8.26 90 top
R116  32.4K  [R0603]  104.78,20.7 0 top
R117  30.1K  [R0603]  104.78,18.54 180 top
R118  20  [R0603]  80.9,10.16 90 top
R119  10K  [R0603]  43.43,9.14 0 top
R120  105  [R0603]  55.88,87 0 top
R121  10K  [R0603]  95.76,81.79 90 top
R122  10K  [R0603]  43.43,6.99 180 top
R123  10K  [R0603]  43.43,4.83 180 top
R124  10K  [R0603]  62.87,24.77 90 bottom
R125  10K  [R0603]  65.02,24.77 90 bottom
R126  10K  [R0603]  67.18,24.77 90 bottom
R127  68  [14-SOIC_CTS]  107.31,38.73 270 top
R128  [14-SOIC_CTS]  83.19,29.21 90 top
R129  [14-SOIC_CTS]  83.19,37.47 270 top
S1  [TACTILE_SWITCH_SMD]  109.86,24.77 0 top
S2  [TACTILE_SWITCH_SMD]  109.86,19.05 180 top
S3  [TACTILE_SWITCH_SMD]  73.03,3.81 180 top
S4  [TACTILE_SWITCH_SMD]  65.41,3.81 0 top
S5  [TACTILE_SWITCH_SMD]  57.78,69.22 270 top
SV1  [MA06-2W]  78.74,77.47 0 top
SV2  [MA05-2]  54.61,26.04 180 top
SV3  MA02-2W  [MA02-2W]  8.26,80.64 0 top
SV5  [MA03-1]  95.89,48.9 180 top
SV7  [MA03-1]  33.02,46.99 90 top
TP1  TEST-POINT2  [PAD.02X.02]  55.88,30.48 0 top
TP2  TEST-POINT2  [PAD.02X.02]  54.61,30.48 0 top
U1  [LQFP32]  91.44,21.59 270 bottom
U2  ADXL345  [LGA14]  110.74,64.77 270 bottom
U3  NL27WZ14  [SOT363]  98.42,67.82 90 bottom
U4  NL27WZ14  [SOT363]  71.75,12.06 0 top
U5  NL27WZ14  [SOT363]  63.5,24.77 0 top
U$1  LT3507  [38-QFN]  12.7,64.14 270 top
U$2  TB6612FNG  [24-SSOP]  84.45,67.31 180 top
U$3  LTC2952  [20-QFN]  51.44,69.22 180 top
U$4  LTC4412  [6-TSOT23]  37.47,70.48 180 top
U$5  MAX745  [20-SSOP]  57.15,85.09 180 top
U$6  MT48H32M16LF  [54-VFBGA]  72.39,52.07 90 top
U$7  NAND1GW3B2C  [63-VFBGA]  72.52,36.45 180 top
U$8  SI5401DC  [1206-8_CHIPFET]  41.27,69.22 270 bottom
U$9  SI5401DC  [1206-8_CHIPFET]  41.91,67.31 0 top
U$10  SI5401DC  [1206-8_CHIPFET]  45.72,69.85 0 bottom
U$11  SI5401DC  [1206-8_CHIPFET]  45.72,69.85 0 top
U$12  SI5401DC  [1206-8_CHIPFET]  41.91,71.12 180 top
U$16  PCA9306  [TSSOP8]  111.12,66.67 90 top
U$17  NSS30071MR6T1G  [6-SC74]  5.08,55.88 90 bottom
U$18  PCA9306  [TSSOP8]  57.78,59.05 180 top
U$19  IRF7303  [8-SOIC]  57.15,81.92 90 bottom
U$20  MICRO-SD  [MICRO_SD]  60.96,1.91 0 top
U$21  DP83848J  [40-LLP]  31.11,31.75 0 bottom
U$22  LPC3240  [SOT1048-1]  51.18,43.69 180 top
U$23  MCP1702  [SOT23]  24.13,81.92 0 top
U$25  STOTG04E  [QFN-24]  82.55,15.24 270 top
U$26  DS2786  [10-TDFN]  28.57,80.01 90 top
U$27  TB6612FNG  [24-SSOP]  77.47,67.31 180 bottom
U$28  LISY300ALSMD  [LGA28]  87,57.15 180 top
U$29  AVR_SPI_PRG_6PTH  [2X3]  104.14,53.98 0 top
U$30  AT86RF231  [32-QFN]  25.4,43.18 180 bottom
U$31  CC2591  [16-QFN]  15.88,43.18 270 bottom
U$32  LED-TRICOLOR-THROUGHHOLE  [LED-TRICOLOR-THROUGHHOLE]  10.79,4.83 90 top
U$33  A4983  [28-QFN]  104.78,80.64 270 bottom
U$34  LED-TRICOLOR-THROUGHHOLE  [LED-TRICOLOR-THROUGHHOLE]  104.14,3.81 0 top
U$35  PCA9306  [TSSOP8]  89.53,81.28 0 bottom
U$36  PCA9306  [TSSOP8]  90.81,44.45 180 bottom
U$37  PCA9306  [TSSOP8]  95.38,54.36 0 top
U$38  1.5nH  [0603]  14.1,39.88 90 top
X1  MINI-USB-UX60-MB-5S8  [UX60-MB-5S8]  93.34,0.64 90 top

## Tracks (layer width: path | path; a pad name or v marks a point on that pad's centre or on a via)
!ARM_RST  (2 unrouted)
!AVR_RESET  (1 unrouted)
!PWR_BATT  (2 unrouted)
!PWR_INT  (2 unrouted)
!PWR_KILL  (1 unrouted)
!USB_ATX_INT  (1 unrouted)
!USB_OE_TP  (1 unrouted)
!WL_RST  (2 unrouted)
!WL_SPI_CS  (1 unrouted)
+1.2V  (24 unrouted)
  Top 0.152: U$22.G7 52.76,41.27 52.07,41.27 51.65,41.69 U$22.G9 51.16,41.27 50.4,41.27 U$22.G11 49.98,42.49 U$22.J12 | U$22.M11 U$22.L12 U$22.M13
+1.8V  (29 unrouted)
  Top 0.152: U$22.N8 U$22.M8 | U$22.N8 U$22.N9 U$22.N10 U$22.N11 | U$22.N8 U$22.N7 U$22.M6 U$22.L6 U$22.K6 | U$22.K6 U$22.J6 | U$22.K7 U$22.K6
+3V3  (98 unrouted)
  Top 0.152: U$7.J6 72.5,38.83 72.5,40
+5V  (54 unrouted)
ACCES_ADC0  (1 unrouted)
ACCES_ADC1  (1 unrouted)
ACCES_DETECT  (2 unrouted)
ACCES_PIN0  (1 unrouted)
ACCES_PIN1  (1 unrouted)
  Top 0.178: U$22.K4 55.59,44.09 56,44.5
ARM_DBGEN  (1 unrouted)
AVR_ADC4  (1 unrouted)
AVR_ADC5  (1 unrouted)
AVR_ADC6  (1 unrouted)
AVR_ADC7  (1 unrouted)
AVR_SCK  (1 unrouted)
AVR_SCL_3.3V  (2 unrouted)
AVR_SCL_5V  (2 unrouted)
AVR_SDA_3.3V  (2 unrouted)
AVR_SDA_5V  (2 unrouted)
AVRISP_MISO  (2 unrouted)
AVRISP_MOSI  (2 unrouted)
BATT_GND  (4 unrouted)
BATT_SCL_3.3V  (2 unrouted)
BATT_SCL_5V  (2 unrouted)
BATT_SDA_3.3V  (2 unrouted)
BATT_SDA_5V  (2 unrouted)
CHARGE_GND  (2 unrouted)
EDGE_DETECT_0  (1 unrouted)
EDGE_DETECT_1  (1 unrouted)
EDGE_DETECT_2  (1 unrouted)
ETH_RD+  (2 unrouted)
ETH_RD-  (2 unrouted)
ETH_TD+  (2 unrouted)
ETH_TD-  (2 unrouted)
EXT_BUT_0  (1 unrouted)
EXT_BUT_0_RAW  (2 unrouted)
EXT_BUT_1  (1 unrouted)
EXT_BUT_1_RAW  (2 unrouted)
GND  (334 unrouted)
  Top 0.152: U$22.M10 U$22.M9
GYRO_OUT  (3 unrouted)
GYRO_PD_3.3V  (1 unrouted)
GYRO_PD_5V  (1 unrouted)
GYRO_ST_3.3V  (1 unrouted)
GYRO_ST_5V  (1 unrouted)
I2C_SCL_3.3V  (3 unrouted)
I2C_SCL_5V  (3 unrouted)
I2C_SDA_3.3V  (3 unrouted)
I2C_SDA_5V  (1 unrouted)
JTAG_NTRST  (1 unrouted)
JTAG_TCK  (1 unrouted)
JTAG_TDI  (1 unrouted)
JTAG_TDO  (1 unrouted)
JTAG_TMS  (1 unrouted)
LED0  (1 unrouted)
LED1  (1 unrouted)
LED2  (1 unrouted)
LED3  (1 unrouted)
LED4  (1 unrouted)
LED5  (1 unrouted)
LED6  (1 unrouted)
LED7  (1 unrouted)
LED8  (1 unrouted)
LED9  (1 unrouted)
LED10  (1 unrouted)
LED11  (1 unrouted)
MOTOR0+  (2 unrouted)
MOTOR0-  (2 unrouted)
MOTOR0_ENC_A  (1 unrouted)
MOTOR0_ENC_B  (1 unrouted)
MOTOR1+  (2 unrouted)
MOTOR1-  (2 unrouted)
MOTOR1_ENC_A  (1 unrouted)
MOTOR1_ENC_B  (1 unrouted)
MOTOR2+  (2 unrouted)
MOTOR2-  (2 unrouted)
MOTOR2_ENC_A  (1 unrouted)
MOTOR2_ENC_B  (1 unrouted)
MOTOR3+  (2 unrouted)
MOTOR3-  (2 unrouted)
MOTOR3_ENC_A  (1 unrouted)
MOTOR3_ENC_B  (1 unrouted)
N$1  (3 unrouted)
N$2  (1 unrouted)
N$3  (1 unrouted)
N$4  (2 unrouted)
N$5  (1 unrouted)
N$6  (2 unrouted)
N$7  (2 unrouted)
N$8  (4 unrouted)
N$9  (1 unrouted)
N$10  (4 unrouted)
N$11  (1 unrouted)
N$12  (1 unrouted)
N$13  (2 unrouted)
N$14  (1 unrouted)
N$15  (1 unrouted)
N$16  (2 unrouted)
N$18  (2 unrouted)
N$19  (2 unrouted)
N$20  (1 unrouted)
N$21  (1 unrouted)
N$22  (2 unrouted)
N$23  (1 unrouted)
N$24  (1 unrouted)
N$25  (1 unrouted)
N$26  (1 unrouted)
  Top 0.152: U$22.U4 55.95,50.05 55.95,52.7
N$27  (2 unrouted)
N$28  (1 unrouted)
N$29  (1 unrouted)
N$30  (1 unrouted)
  Top 0.152: U$22.U5 55.15,50.05 55.15,52.7
N$31  (1 unrouted)
  Top 0.152: U$22.V3 56.39,50.49 56.39,53.99 56.8,54.4 | U$6.C8 71.18,54.86 71.18,55.83
N$32  (1 unrouted)
  Top 0.152: U$22.V4 55.57,54.77 56,55.2
N$33  (1 unrouted)
N$34  (1 unrouted)
N$35  (1 unrouted)
  Top 0.152: U$22.V5 54.8,50.5 54.8,54.4
N$36  (1 unrouted)
  Top 0.152: U$22.U6 54.36,50.21 54.36,53.6
N$37  (1 unrouted)
  Top 0.152: U$22.V6 53.97,50.49 53.96,53.6
N$38  (1 unrouted)
N$39  (1 unrouted)
  Top 0.152: U$22.U7 53.57,50.06 53.57,53.59
N$40  (1 unrouted)
  Top 0.152: U$22.V7 53.18,53.58
N$41  (1 unrouted)
N$42  (1 unrouted)
  Top 0.152: U$22.U8 52.78,50.07 52.78,52.23
N$43  (1 unrouted)
N$44  (1 unrouted)
N$45  (1 unrouted)
N$46  (1 unrouted)
N$47  (1 unrouted)
  Top 0.152: U$22.T2 58,49.71 58,53
N$48  (1 unrouted)
N$49  (1 unrouted)
N$50  (1 unrouted)
  Top 0.152: U$22.U3 56.8,50.1 56.8,51.2
N$51  (1 unrouted)
N$52  (2 unrouted)
N$53  (3 unrouted)
N$54  (1 unrouted)
  Top 0.152: U$22.H2 57.57,42.9 60.86,42.9
N$55  (1 unrouted)
N$56  (1 unrouted)
  Top 0.152: U$22.F1 57.97,40.91 61.4,40.91
N$57  (1 unrouted)
  Top 0.152: U$22.E1 61.4,40.1
N$58  (1 unrouted)
N$59  (1 unrouted)
  Top 0.152: U$22.G2 57.56,42.09 61.01,42.09
N$60  (1 unrouted)
N$61  (1 unrouted)
  Top 0.152: U$22.E2 57.56,40.5 61.5,40.5
N$62  (1 unrouted)
N$63  (1 unrouted)
  Top 0.152: U$22.D2 57.55,39.69 61.43,39.69
N$64  (1 unrouted)
  Top 0.152: U$22.F2 57.55,41.28 61.15,41.28
N$65  (1 unrouted)
  Top 0.152: U$22.C1 57.98,38.52 61.53,38.52
N$66  (1 unrouted)
N$67  (1 unrouted)
  Top 0.152: U$22.D1 61.57,39.3
N$68  (1 unrouted)
N$69  (1 unrouted)
N$70  (1 unrouted)
N$71  (1 unrouted)
N$72  (1 unrouted)
N$73  (2 unrouted)
N$74  (2 unrouted)
N$75  (11 unrouted)
N$76  (1 unrouted)
N$77  (1 unrouted)
N$78  (2 unrouted)
N$79  (1 unrouted)
N$80  (2 unrouted)
N$81  (2 unrouted)
N$82  (1 unrouted)
N$83  (6 unrouted)
N$84  (1 unrouted)
N$85  (2 unrouted)
N$86  (1 unrouted)
N$87  (2 unrouted)
N$88  (1 unrouted)
N$89  (1 unrouted)
N$90  (1 unrouted)
N$91  (1 unrouted)
N$92  (1 unrouted)
N$93  (2 unrouted)
N$94  (1 unrouted)
N$95  (4 unrouted)
N$96  (1 unrouted)
N$97  (4 unrouted)
N$98  (1 unrouted)
N$99  (1 unrouted)
N$100  (1 unrouted)
N$101  (1 unrouted)
N$102  (1 unrouted)
N$103  (1 unrouted)
N$104  (1 unrouted)
N$105  (1 unrouted)
N$106  (1 unrouted)
N$107  (2 unrouted)
N$108  (1 unrouted)
N$109  (1 unrouted)
N$110  (1 unrouted)
N$111  (1 unrouted)
N$112  (1 unrouted)
N$113  (1 unrouted)
N$114  (1 unrouted)
N$115  (1 unrouted)
N$116  (1 unrouted)
N$117  (1 unrouted)
N$118  (1 unrouted)
N$119  (1 unrouted)
N$120  (2 unrouted)
N$121  (2 unrouted)
N$122  (2 unrouted)
N$123  (6 unrouted)
N$124  (1 unrouted)
N$125  (1 unrouted)
N$126  (1 unrouted)
N$127  (via drill 0.15)
  other vias: 55.97,44.48
N$128  (1 unrouted)
N$129  (1 unrouted)
N$132  (1 unrouted)
N$133  (1 unrouted)
N$134  (2 unrouted)
N$135  (2 unrouted)
N$136  (2 unrouted)
N$137  (1 unrouted)
N$138  (1 unrouted)
N$139  (1 unrouted)
N$140  (1 unrouted)
N$141  (4 unrouted)
N$142  (1 unrouted)
N$143  (1 unrouted)
N$144  (2 unrouted)
N$145  (2 unrouted)
N$146  (1 unrouted)
N$147  (5 unrouted)
N$148  (2 unrouted)
N$149  (1 unrouted)
N$150  (1 unrouted)
N$151  (1 unrouted)
N$152  (1 unrouted)
N$153  (1 unrouted)
N$154  (1 unrouted)
N$155  (1 unrouted)
N$156  (1 unrouted)
N$157  (2 unrouted)
N$158  (1 unrouted)
N$159  (2 unrouted)
N$160  (2 unrouted)
N$161  (2 unrouted)
N$162  (2 unrouted)
N$163  (2 unrouted)
N$164  (1 unrouted)
N$165  (1 unrouted)
N$166  (1 unrouted)
N$167  (1 unrouted)
N$168  (1 unrouted)
N$169  (1 unrouted)
N$170  (1 unrouted)
N$171  (1 unrouted)
N$172  (1 unrouted)
N$173  (1 unrouted)
N$174  (2 unrouted)
N$175  (1 unrouted)
N$176  (1 unrouted)
N$177  (1 unrouted)
N$178  (1 unrouted)
N$179  (2 unrouted)
N$180  (2 unrouted)
N$181  (2 unrouted)
N$182  (2 unrouted)
N$183  (1 unrouted)
N$184  (1 unrouted)
N$185  (2 unrouted)
N$186  (1 unrouted)
N$187  (1 unrouted)
N$188  (1 unrouted)
N$190  (2 unrouted)
N$191  (1 unrouted)
N$192  (2 unrouted)
N$193  (1 unrouted)
N$194  (1 unrouted)
N$195  (1 unrouted)
N$196  (1 unrouted)
N$197  (1 unrouted)
N$198  (2 unrouted)
N$199  (1 unrouted)
N$200  (1 unrouted)
N$201  (1 unrouted)
N$202  (1 unrouted)
N$203  (1 unrouted)
N$204  (1 unrouted)
N$205  (1 unrouted)
N$206  (2 unrouted)
N$207  (1 unrouted)
N$208  (1 unrouted)
N$209  (1 unrouted)
N$210  (3 unrouted)
N$211  (1 unrouted)
N$212  (1 unrouted)
N$213  (1 unrouted)
N$214  (1 unrouted)
N$215  (1 unrouted)
N$216  (1 unrouted)
N$217  (1 unrouted)
N$218  (1 unrouted)
N$219  (1 unrouted)
N$220  (1 unrouted)
N$222  (1 unrouted)
N$223  (1 unrouted)
N$224  (1 unrouted)
N$225  (1 unrouted)
N$226  (1 unrouted)
N$227  (1 unrouted)
N$228  (1 unrouted)
N$229  (1 unrouted)
N$230  (1 unrouted)
N$231  (1 unrouted)
N$232  (1 unrouted)
N$233  (1 unrouted)
N$234  (1 unrouted)
N$235  (1 unrouted)
N$236  (1 unrouted)
N$237  (1 unrouted)
N$238  (2 unrouted)
N$239  (2 unrouted)
N$240  (2 unrouted)
N$241  (4 unrouted)
N$242  (2 unrouted)
N$243  (4 unrouted)
N$244  (1 unrouted)
N$245  (1 unrouted)
N$246  (1 unrouted)
N$247  (1 unrouted)
N$248  (1 unrouted)
N$249  (1 unrouted)
N$250  (1 unrouted)
N$257  (1 unrouted)
N$258  (2 unrouted)
N$262  (1 unrouted)
N$263  (1 unrouted)
N$264  (1 unrouted)
N$265  (1 unrouted)
N$272  (1 unrouted)
N$273  (1 unrouted)
N$274  (2 unrouted)
N$275  (2 unrouted)
N$276  (2 unrouted)
N$277  (3 unrouted)
N$278  (3 unrouted)
N$279  (3 unrouted)
N$280  (2 unrouted)
N$281  (3 unrouted)
N$282  (1 unrouted)
N$283  (1 unrouted)
N$284  (2 unrouted)
N$285  (6 unrouted)
N$286  (2 unrouted)
N$287  (1 unrouted)
N$289  (2 unrouted)
N$290  (1 unrouted)
N$291  (1 unrouted)
N$292  (1 unrouted)
N$293  (1 unrouted)
N$294  (1 unrouted)
N$295  (1 unrouted)
N$296  (1 unrouted)
N$297  (1 unrouted)
N$298  (1 unrouted)
N$299  (1 unrouted)
N$300  (1 unrouted)
N$301  (1 unrouted)
N$302  (5 unrouted)
N$303  (1 unrouted)
ORB0_B  (3 unrouted)
ORB0_G  (3 unrouted)
ORB0_R  (3 unrouted)
ORB1_B  (3 unrouted)
ORB1_G  (1 unrouted)
ORB1_R  (3 unrouted)
PWR_EN  (3 unrouted)
PWR_WDOG  (1 unrouted)
SDRAM_ADDR0  (1 unrouted)
SDRAM_ADDR1  (1 unrouted)
SDRAM_ADDR2  (1 unrouted)
  Top 0.152: U$22.M1 57.98,45.7
  Top 0.178: 57.98,45.7 61.5,45.7
SDRAM_ADDR3  (1 unrouted)
  Top 0.152: U$22.M2 57.58,46.08
  Top 0.178: 57.58,46.08 61.49,46.07
SDRAM_ADDR4  (1 unrouted)
SDRAM_ADDR5  (1 unrouted)
  Top 0.152: U$22.N1 57.98,46.48
  Top 0.178: 57.98,46.48 61.5,46.48
SDRAM_ADDR6  (1 unrouted)
  Top 0.152: U$22.N2 57.54,46.86 61.55,46.86
SDRAM_ADDR7  (1 unrouted)
SDRAM_ADDR8  (1 unrouted)
SDRAM_ADDR9  (1 unrouted)
  Top 0.152: U$22.P1 57.98,47.3 61.5,47.3
SDRAM_ADDR10  (1 unrouted)
  Top 0.152: U$22.P2 57.58,47.69 61.52,47.69
SDRAM_ADDR11  (1 unrouted)
SDRAM_ADDR12  (1 unrouted)
SDRAM_ADDR13  (1 unrouted)
  Top 0.152: U$22.R1 57.98,48.08 61.49,48.08
SDRAM_ADDR14  (1 unrouted)
  Top 0.152: U$22.R2 57.58,48.49 61.5,48.49 | U$6.G5 73.99,54.49 74.36,54.86 74.36,55.78 74.37,55.79
SONAR_RX  (1 unrouted)
SONAR_TX  (1 unrouted)
STEP_1A  (1 unrouted)
STEP_1B  (1 unrouted)
STEP_2A  (1 unrouted)
STEP_2B  (1 unrouted)
STEP_DIR  (1 unrouted)
STEP_STEP  (1 unrouted)
USB_DAT_VP  (1 unrouted)
USB_I2C_SCL  (1 unrouted)
USB_I2C_SDA  (1 unrouted)
USB_RX_LED  (1 unrouted)
USB_SE0_VM  (1 unrouted)
USB_TX_LED  (1 unrouted)
USR_BUT_0  (1 unrouted)
USR_BUT_1  (1 unrouted)
V_LOGIC  (12 unrouted)
VBATT  (8 unrouted)
VBATT_RAW  (1 unrouted)
VCC  (4 unrouted)
VCHARGE  (2 unrouted)
VUSB  (7 unrouted)
WL_EN  (2 unrouted)
WL_HGM  (1 unrouted)
WL_IRQ  (1 unrouted)
WL_SLP_TR  (1 unrouted)
WL_SPI_CLK  (1 unrouted)
WL_SPI_MISO  (1 unrouted)
WL_SPI_MOSI  (1 unrouted)